# Altium schematic sheet CDRon_IMU-BAT.SchDoc
size A4
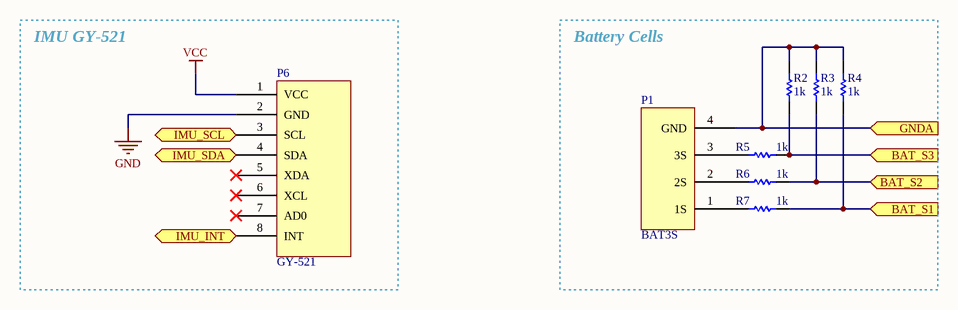
[diagram p0: CDRon_IMU-BAT.SchDoc]

## Parts
P1  BAT3S  [BAT3S]
P6  GY-521  [GY-521]
R2  1k  [R 1206]
R3  1k  [R 1206]
R4  1k  [R 1206]
R5  1k  [R 1206]
R6  1k  [R 1206]
R7  1k  [R 1206]

## Blocks framed on the sheet
IMU GY-521: P6
Battery Cells: P1 R2-R7

## Ports
BAT_S1 (in), BAT_S2 (in), BAT_S3 (in), GNDA (in), IMU_INT (in), IMU_SCL (in), IMU_SDA (in)

## Nets
GND: P6.2(GND)
VCC: P6.1(VCC)
BAT_S1: R4.1 R7.2 ; port BAT_S1
BAT_S2: R3.1 R6.2 ; port BAT_S2
BAT_S3: R2.1 R5.2 ; port BAT_S3
GNDA: P1.4(GND) R2.2 R3.2 R4.2 ; port GNDA
IMU_INT: P6.8(INT) ; port IMU_INT
IMU_SCL: P6.3(SCL) ; port IMU_SCL
IMU_SDA: P6.4(SDA) ; port IMU_SDA
NetP1_1: P1.1(1S) R7.1
NetP1_2: P1.2(2S) R6.1
NetP1_3: P1.3(3S) R5.1

Not connected (* = marked no-connect by the designer): P6 5(XDA)* 6(XCL)* 7(AD0)*

## Library data of the parts
R2-R7 = R: Resistencia; .Creator: SR; .PCBCheck: Used; .SCHCheck: Used; Category: Resistencias